# Altium schematic sheet 06-modem0.SchDoc: Modem
size Letter; DrawnBy: J. Brinton; Engineer: J. Brinton; Revision: 1; SheetNumber: 6; SheetTotal: 14
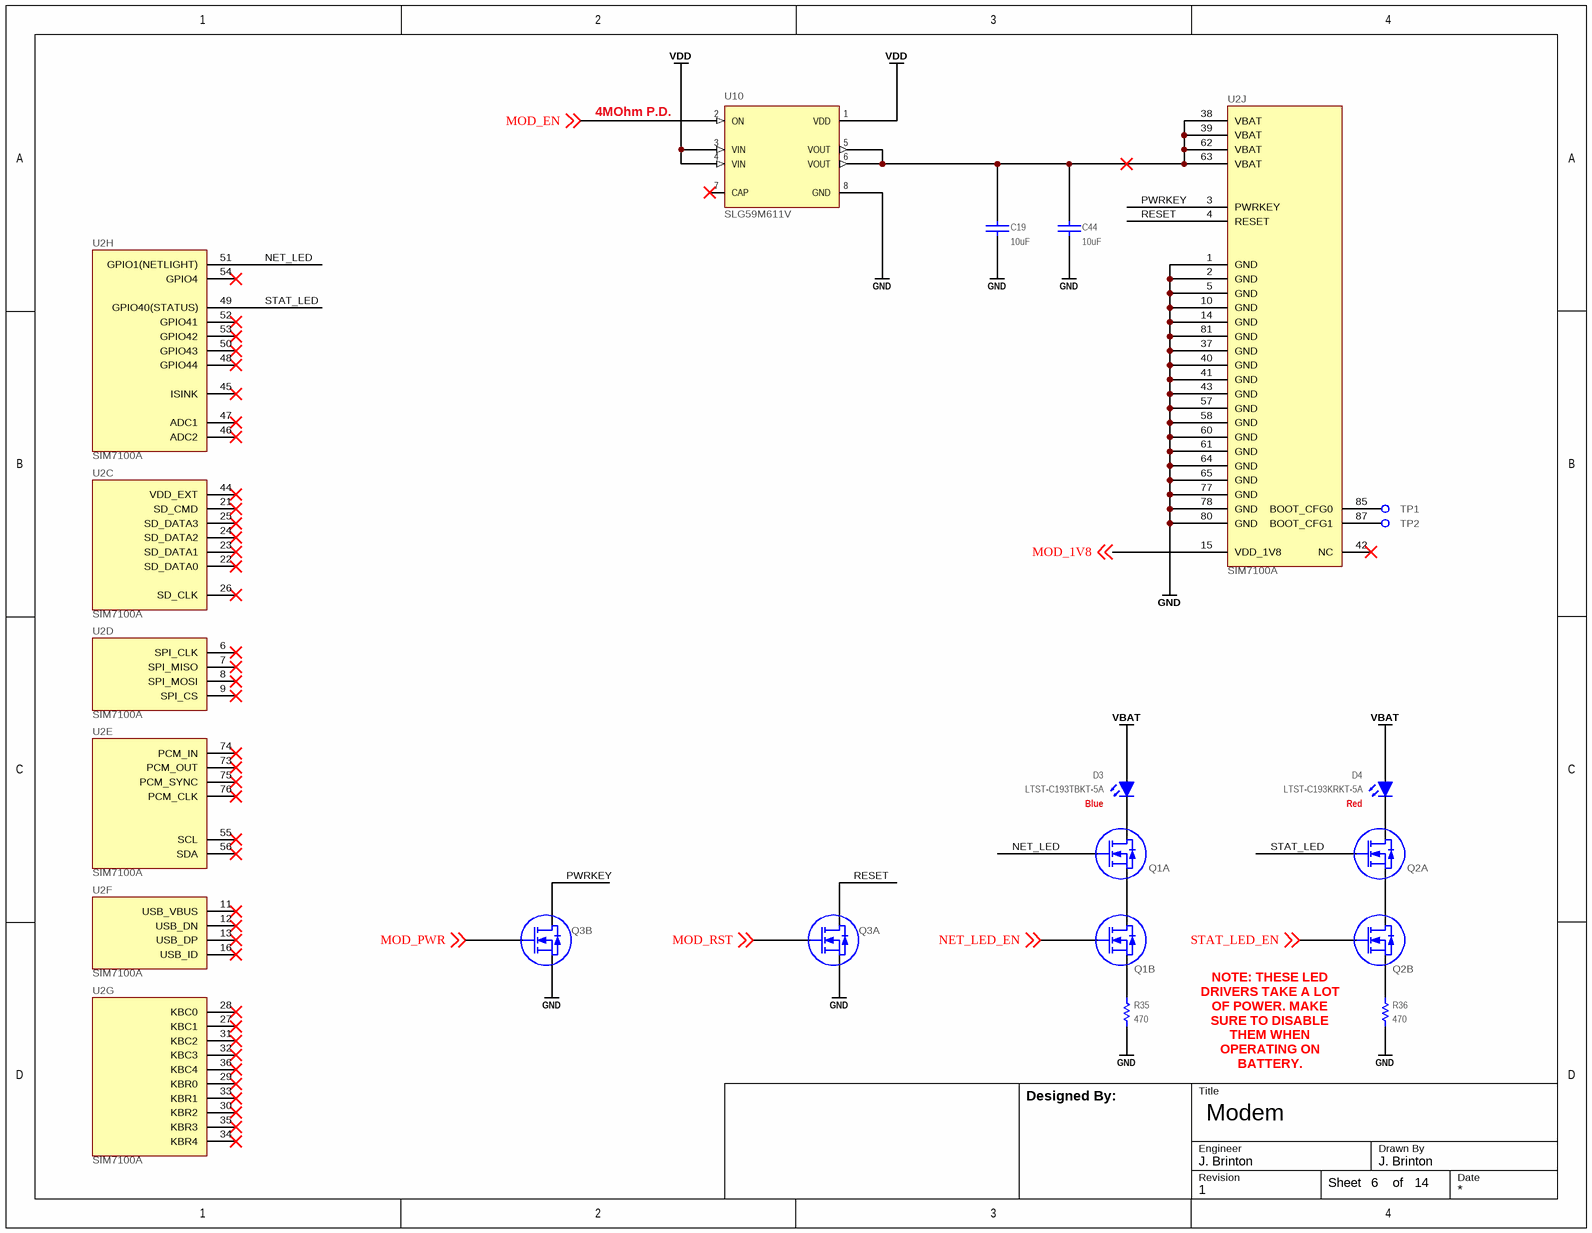
[diagram p0: 06-modem0.SchDoc]

## Parts
C19  value 10uF  [CAPC160X80X90L20N]  (hidden comment: ZRB18AR61E106ME01L)
C44  value 10uF  [CAPC160X80X90L20N]  (hidden comment: ZRB18AR61E106ME01L)
D3  LTST-C193TBKT-5A  [0603_LED]
D4  LTST-C193KRKT-5A  [0603_LED]
Q1  UM6K34NTCN  [SOT363]  (value not drawn)  (parts A,B of 2)
Q2  UM6K34NTCN  [SOT363]  (value not drawn)  (parts A,B of 2)
Q3  UM6K34NTCN  [SOT363]  (value not drawn)  (parts A,B of 2)
R35  value 470  [RESC2012X70N]  (hidden comment: ERJ-6ENF4700V)
R36  value 470  [RESC2012X70N]  (hidden comment: ERJ-6ENF4700V)
TP1  TEST_POINT_SMD_10  [TEST_POINT_SMD_10]  (value not drawn)  (no BOM)
TP2  TEST_POINT_SMD_10  [TEST_POINT_SMD_10]  (value not drawn)  (no BOM)
U2  SIM7100A  [SIM7100A]  (parts C,D,E,F,G,H,J of 10)
U10  SLG59M611V  [DFN200X150X80-8N]

## Nets
GND: C19.1 C44.1 Q3.1(S2) Q3.4(S1) R35.1 R36.1 U2.1(GND) U2.2(GND) U2.5(GND) U2.10(GND) U2.14(GND) U2.37(GND) U2.40(GND) U2.41(GND) U2.43(GND) U2.57(GND) U2.58(GND) U2.60(GND) U2.61(GND) U2.64(GND) U2.65(GND) U2.77(GND) U2.78(GND) U2.80(GND) U2.81(GND) U10.8(GND)
VBAT: D3.1(A) D4.1(A)
VDD: U10.1(VDD) U10.3(VIN) U10.4(VIN)
MOD_1V8: U2.15(VDD_1V8) ; off-sheet MOD_1V8
MOD_EN: U10.2(ON) ; off-sheet MOD_EN
MOD_PWR: Q3.2(G2) ; off-sheet MOD_PWR
MOD_RST: Q3.5(G1) ; off-sheet MOD_RST
NET_LED: Q1.5(G1) U2.51(GPIO1(NETLIGHT))
NET_LED_EN: Q1.2(G2) ; off-sheet NET_LED_EN
PWRKEY: Q3.6(D2) U2.3(PWRKEY)
RESET: Q3.3(D1) U2.4(RESET)
STAT_LED: Q2.5(G1) U2.49(GPIO40(STATUS))
STAT_LED_EN: Q2.2(G2) ; off-sheet STAT_LED_EN
NetC19_2: C19.2 C44.2 U2.38(VBAT) U2.39(VBAT) U2.62(VBAT) U2.63(VBAT) U10.5(VOUT) U10.6(VOUT)
NetD3_2: D3.2(K) Q1.3(D1)
NetD4_2: D4.2(K) Q2.3(D1)
NetQ1_1: Q1.1(S2) R35.2
NetQ1_4: Q1.4(S1) Q1.6(D2)
NetQ2_1: Q2.1(S2) R36.2
NetQ2_4: Q2.4(S1) Q2.6(D2)
NetTP1_1: TP1.1 U2.85(BOOT_CFG0)
NetTP2_1: TP2.1 U2.87(BOOT_CFG1)

Not connected (* = marked no-connect by the designer): U2 6(SPI_CLK)* 7(SPI_MISO)* 8(SPI_MOSI)* 9(SPI_CS)* 11(USB_VBUS)* 12(USB_DN)* 13(USB_DP)* 16(USB_ID)* 21(SD_CMD)* 22(SD_DATA0)* 23(SD_DATA1)* 24(SD_DATA2)* 25(SD_DATA3)* 26(SD_CLK)* 27(KBC1)* 28(KBC0)* 29(KBR0)* 30(KBR2)* 31(KBC2)* 32(KBC3)* 33(KBR1)* 34(KBR4)* 35(KBR3)* 36(KBC4)* 42(NC)* 44(VDD_EXT)* 45(ISINK)* 46(ADC2)* 47(ADC1)* 48(GPIO44)* 50(GPIO43)* 52(GPIO41)* 53(GPIO42)* 54(GPIO4)* 55(SCL)* 56(SDA)* 73(PCM_OUT)* 74(PCM_IN)* 75(PCM_SYNC)* 76(PCM_CLK)*; U10 7(CAP)*

## Notes on the sheet
- 4MOhm P.D.
- Blue
- Red
- (near Q2) NOTE: THESE LED DRIVERS TAKE A LOT OF POWER. MAKE SURE TO DISABLE THEM WHEN OPERATING ON BATTERY.
- Designed By:
- Title
- Engineer
- Revision
- Drawn By
- Date
- Sheet
- of

## Library data of the parts
C19 C44 = CAP 0603: Ceramic Capacitor 10uF ±20% 25V X5R 0603; Manufacturer: Murata; Tr: -55:85; Manufacturer P/N: ZRB18AR61E106ME01L; Voltage: 25V; Package: 0603; Tolerance: ±20%
D3 = LED0603GR: LED, SMT 0603, Color Blue, 5mA, 2.8V; Manufacturer: Lite-On; Manufacturer P/N: LTST-C193TBKT-5A; Package: 0603 Polarized
D4 = LED0603Y: LED, SMT 0603, Color Red, 5mA, 2V; Manufacturer: Lite-On; Manufacturer P/N: LTST-C193KRKT-5A; Package: 0603 Polarized
Q1-Q3 = 2N7002DW-7-F: Dual N-Channel Enhancement Mode MOSFET; Manufacturer: Rohm; Tr: -55:150; Manufacturer P/N: UM6K34NTCN; Package: SOT363
R35 R36 = RES 0402: Thick Film Resistor 470 ±1% 0805; Manufacturer: Panasonic; Tr: -55:155; Package: 0805; Manufacturer P/N: ERJ-6ENF4700V; Tolerance: ±1%
TP1 TP2 = TEST_POINT_SMD_10: Test Point SMD
U2 = Component_1: Cellular Module; Manufacturer: SIMCOM; Manufacturer P/N: SIM7100A
U10 = SLG59M611V: High-Side Load Switch; Manufacturer: Silego; Package: WFDFN-8 Silego; Manufacturer P/N: SLG59M611V